# EAGLE schematic Tiny Tetris v1.2 (EAGLE 7.0.0)
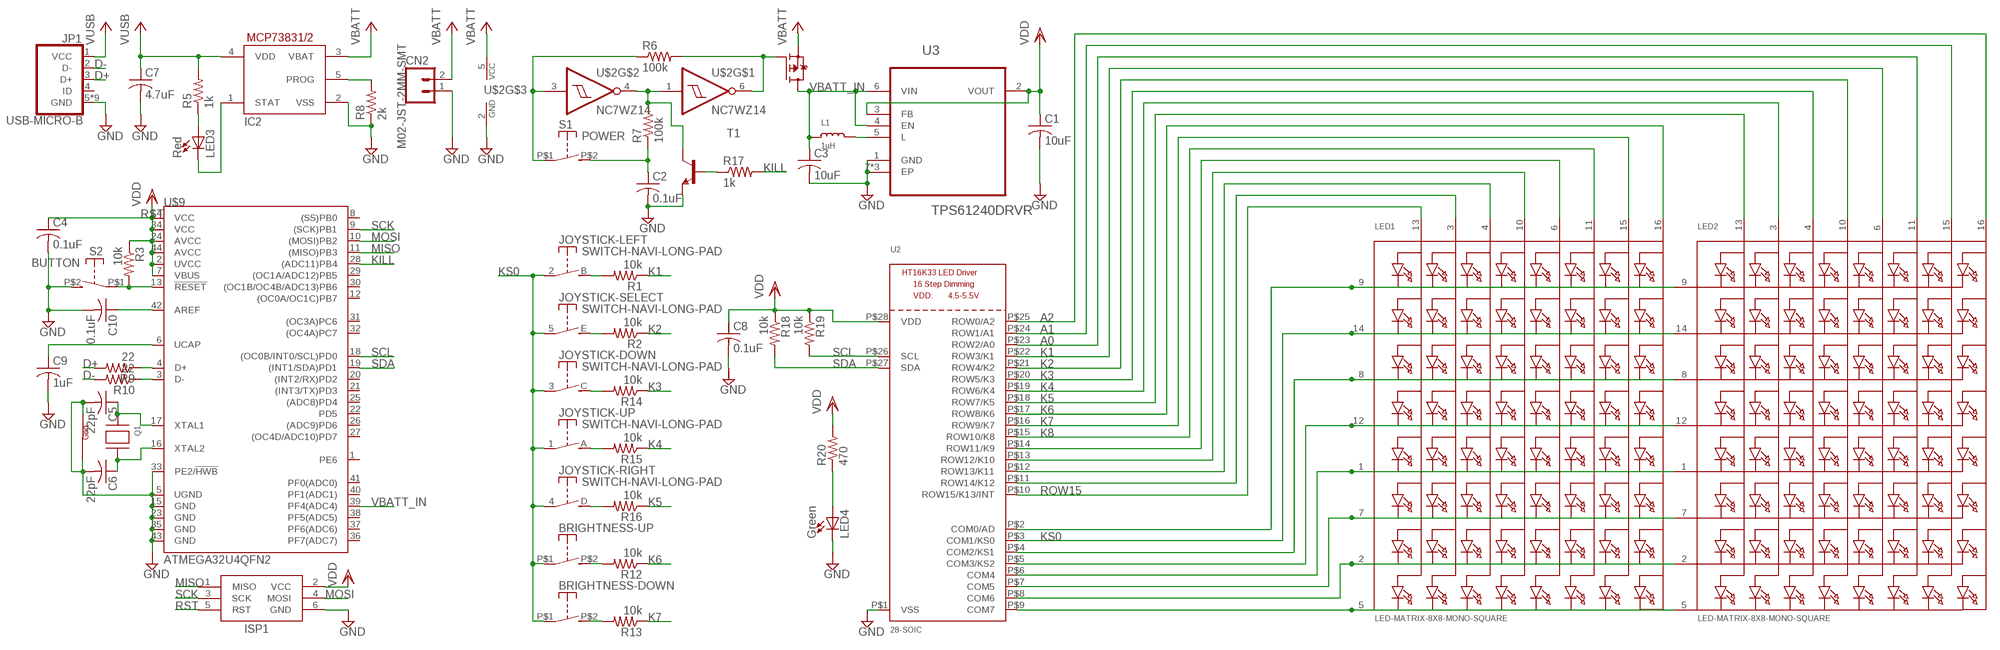
[diagram p0: schematic, sheet 1]

## Parts
BRIGHTNESS-DOWN  SWITCH-TACTSKRELGE010  [TACT-ALPS-SKRELGE010]
BRIGHTNESS-UP  SWITCH-TACTSKRELGE010  [TACT-ALPS-SKRELGE010]
C1  10uF  C-USC0603K  [C0603K]
C2  0.1uF  C-USC0603K  [C0603K]
C3  10uF  C-USC0603K  [C0603K]
C4  0.1uF  C-USC0603K  [C0603K]
C5  22pF  C-USC0603K  [C0603K]
C6  22pF  C-USC0603K  [C0603K]
C7  4.7uF  C-USC0603K  [C0603K]
C8  0.1uF  C-USC0603K  [C0603K]
C9  1uF  C-USC0603K  [C0603K]
C10  0.1uF  C-USC0603K  [C0603K]
CN2  M02-JST-2MM-SMT  M021X02_NO_SILK  [1X02_NO_SILK]
IC2  MCP73831/OT  [SOT23-5L]
ISP1  AVRISP-6  [AVRISP]
JOYSTICK-  SWITCH-NAVI-LONG-PAD  [JOYSTICK-NOKIA-3230-LONG-PAD]
JP1  USB-MICRO-B  [MICRO-USB-FCI-10103594]
L1  1uH  INDUCTOR0805  [0805]
LED1  LED-MATRIX-8X8-MONO-SQUARE  [LED-MATRIX-8X8-MONO-SQUARE]
LED2  LED-MATRIX-8X8-MONO-SQUARE  [LED-MATRIX-8X8-MONO-SQUARE]
LED3  Red  LED  [LED-0603-SIDEVIEW]
LED4  Green  LED  [LED-0603-SIDEVIEW]
Q1  XTAL-4-3225  [NX3225]
R1  10k  R-US_R0603  [R0603]
R2  10k  R-US_R0603  [R0603]
R3  10k  R-US_R0603  [R0603]
R5  1k  R-US_R0603  [R0603]
R6  100k  R-US_R0603  [R0603]
R7  100k  R-US_R0603  [R0603]
R8  2k  R-US_R0603  [R0603]
R9  22  R-US_R0603  [R0603]
R10  22  R-US_R0603  [R0603]
R12  10k  R-US_R0603  [R0603]
R13  10k  R-US_R0603  [R0603]
R14  10k  R-US_R0603  [R0603]
R15  10k  R-US_R0603  [R0603]
R16  10k  R-US_R0603  [R0603]
R17  1k  R-US_R0603  [R0603]
R18  10k  R-US_R0603  [R0603]
R19  10k  R-US_R0603  [R0603]
R20  470  R-US_R0603  [R0603]
S1  POWER  SWITCH-TACTSKRELGE010  [TACT-ALPS-SKRELGE010]
S2  BUTTON  SWITCH-TACTSKRELGE010  [TACT-ALPS-SKRELGE010]
T1  MMBT2222ALT1-NPN-SOT23-BEC  [SOT23-BEC]
U2  28-SOIC  HT16K33_SOP28  [SOP28_300MIL]
U3  TPS61240DRVR  [SON65P200X200X80-7N]
U$1  IRLML6402  [SOT23]
U$2  NC7WZ14  [SC-70-6]
U$9  ATMEGA32U4QFN2  [SPARKFUN-DIGITALIC_QFN-44-NOPAD]

## Nets
A0: LED2.11(A6) U2.P$23(ROW2/A0)
A1: LED2.15(A7) U2.P$24(ROW1/A1)
A2: LED2.16(A8) U2.P$25(ROW0/A2)
D+: JP1.3(D+) R9.2
D-: JP1.2(D-) R10.2
GND: C1.2 C2.2 C3.2 C4.2 C5.2 C6.2 C7.2 C8.2 C9.2 C10.2 CN2.1 IC2.2(VSS) ISP1.6(GND) JP1.5(GND) JP1.P$1(GND) JP1.P$2(GND) JP1.P$3(GND) JP1.P$4(GND) JP1.P$5(GND) JP1.P$6(GND) JP1.P$7(GND) JP1.P$8(GND) LED4.P$2(C) Q1.2(G2) Q1.4(G1) R8.1 S2.P$2(S) T1.E U2.P$1(VSS) U3.1(GND) U3.7(EP) U3.8(EP) U3.9(EP) U$2.2(GND) U$9.5(UGND) U$9.15(GND) U$9.23(GND) U$9.33(PE2/!HWB) U$9.35(GND) U$9.43(GND)
K1: LED2.6(A5) R1.1 U2.P$22(ROW3/K1)
K2: LED2.10(A4) R2.1 U2.P$21(ROW4/K2)
K3: LED2.4(A3) R14.1 U2.P$20(ROW5/K3)
K4: LED2.3(A2) R15.1 U2.P$19(ROW6/K4)
K5: LED2.13(A1) R16.1 U2.P$18(ROW7/K5)
K6: LED1.16(A8) R12.1 U2.P$17(ROW8/K6)
K7: LED1.15(A7) R13.1 U2.P$16(ROW9/K7)
K8: LED1.11(A6) U2.P$15(ROW10/K8)
KILL: R17.2 U$9.28((ADC11)PB4)
KS0: BRIGHTNESS-DOWN.P$1(P) BRIGHTNESS-UP.P$1(P) JOYSTICK-.1(UP:P) JOYSTICK-.2(LEFT:P) JOYSTICK-.3(DOWN:P) JOYSTICK-.4(RIGHT:P) JOYSTICK-.5(SELECT:P) LED1.14(K2) LED2.14(K2) U2.P$3(COM1/KS0)
MISO: ISP1.1(MISO) U$9.11((MISO)PB3)
MOSI: ISP1.4(MOSI) U$9.10((MOSI)PB2)
N$1: LED1.5(K8) LED2.5(K8) U2.P$9(COM7)
N$2: LED3.P$1(A) R5.1
N$3: JOYSTICK-.C(DOWN:S) R14.2
N$4: R6.2 U$1.1(G) U$2.6(O)
N$5: R17.1 T1.B
N$6: R6.1 S1.P$1(P) U$2.3(I)
N$7: JOYSTICK-.E(SELECT:S) R2.2
N$8: LED1.9(K1) LED2.9(K1) U2.P$2(COM0/AD)
N$9: JOYSTICK-.D(RIGHT:S) R16.2
N$10: C2.1 R7.1 S1.P$2(S)
N$11: JOYSTICK-.B(LEFT:S) R1.2
N$12: R7.2 T1.C U$2.1(I) U$2.4(O)
N$13: JOYSTICK-.A(UP:S) R15.2
N$15: C10.1 U$9.42(AREF)
N$16: R9.1 U$9.4(D+)
N$17: IC2.1(STAT) LED3.P$2(C)
N$18: IC2.5(PROG) R8.2
N$19: R10.1 U$9.3(D-)
N$20: C9.1 U$9.6(UCAP)
N$21: BRIGHTNESS-UP.P$2(S) R12.2
N$22: LED1.3(A2) U2.P$11(ROW14/K12)
N$23: LED1.4(A3) U2.P$12(ROW13/K11)
N$24: LED1.10(A4) U2.P$13(ROW12/K10)
N$25: LED1.6(A5) U2.P$14(ROW11/K9)
N$26: BRIGHTNESS-DOWN.P$2(S) R13.2
N$27: LED4.P$1(A) R20.1
N$29: L1.2 U3.5(L)
N$30: LED1.8(K3) LED2.8(K3) U2.P$4(COM2/KS1)
N$31: C5.1 Q1.1(X1) U$9.17(XTAL1)
N$32: LED1.12(K4) LED2.12(K4) U2.P$5(COM3/KS2)
N$33: LED1.1(K5) LED2.1(K5) U2.P$6(COM4)
N$34: LED1.7(K6) LED2.7(K6) U2.P$7(COM5)
N$35: LED1.2(K7) LED2.2(K7) U2.P$8(COM6)
N$36: C6.1 Q1.3(X2) U$9.16(XTAL2)
ROW15: LED1.13(A1) U2.P$10(ROW15/K13/INT)
RST: ISP1.5(RST) R3.2 S2.P$1(P) U$9.13(!RESET)
SCK: ISP1.3(SCK) U$9.9((SCK)PB1)
SCL: R19.2 U2.P$26(SCL) U$9.18((OC0B/INT0/SCL)PD0)
SDA: R18.2 U2.P$27(SDA) U$9.19((INT1/SDA)PD1)
VBATT: CN2.2 IC2.3(VBAT) U$1.2(S) U$2.5(VCC)
VBATT_IN: C3.1 L1.1 U3.4(EN) U3.6(VIN) U$1.3(D) U$9.39(PF4(ADC4))
VDD: C1.1 C4.1 C8.1 ISP1.2(VCC) R3.1 R18.1 R19.1 R20.2 U2.P$28(VDD) U3.2(VOUT) U3.3(FB) U$9.2(UVCC) U$9.7(VBUS) U$9.14(VCC) U$9.24(AVCC) U$9.34(VCC) U$9.44(AVCC)
VUSB: C7.1 IC2.4(VDD) JP1.1(VCC) R5.2
Unconnected: JP1.4(ID) U$9.1(PE6) U$9.8((SS)PB0) U$9.12((OC0A/OC1C)PB7) U$9.20((INT2/RX)PD2) U$9.21((INT3/TX)PD3) U$9.22(PD5) U$9.25((ADC8)PD4) U$9.26((ADC9)PD6) U$9.27((OC4D/ADC10)PD7) U$9.29((OC1A/ADC12)PB5) U$9.30((OC1B/OC4B/ADC13)PB6) U$9.31((OC3A)PC6) U$9.32((OC4A)PC7) U$9.36(PF7(ADC7)) U$9.37(PF6(ADC6)) U$9.38(PF5(ADC5)) U$9.40(PF1(ADC1)) U$9.41(PF0(ADC0))

## Library data of the parts
BRIGHTNESS-DOWN BRIGHTNESS-UP S1 S2 = Jianan Li:SWITCH-TACT
C1-C10 = resistor:C-US: CAPACITOR, American symbol
CN2 = SparkFun-Connectors:M02: Standard 2-pin 0.1" header. Use with - straight break away headers ( PRT-00116) - right angle break away headers (PRT-00553) - swiss pins (PRT-00743) - machine pins (PRT-00117) - female headers (PRT-00115) Molex polarized connector foot print use with: PRT-08233 with associated crimp pins and housings. 2.54_SCREWTERM for use with PRT-10571. 3.5mm Screw Terminal footprints for PRT-08084 5mm Screw Terminal footprints for use with PRT-08433
IC2 = adafruit:MCP73831: MCP73831/2 Miniature Single-Cell, Fully Integrated Li-Ion, Li-Polymer Charge Management Controllers. Nice and small simple lipoly charge controller, with adjustable current and status output (LED) http://www.ladyada.net/library/pcb/eaglelibrary.html
ISP1 = adafruit:AVRISP: AVR ISP HEADER Standard 6 pin header for AVR programming
JOYSTICK- = Jianan Li:SWITCH-NAVI
JP1 = Jianan Li:USB-MICRO-B
L1 = microbuilder:INDUCTOR: Inductors 0603: 10nH Ceramic Inductor - microwire antenna/RF (Digikey: 712-1434-2-ND) 0805: 560nH Ceramic Inductor - RF (Digikey: 553-1047-1-ND) 270nH Ceramic Inductor - Q = 40@250MHz, +-5%, 1 Ohm DC Resistance (Digikey: 535-10506-2-ND) 1007 (2518 Metric) SMT: 10µH 10% 250mOhm 820mA 1007 Inductor (Digikey: 587-2189-1-ND) 22µH 10% 500mOhm 580mA 1007 Inductor (Digikey: 587-2190-1-ND) 47µH 10% 950mOhm 420mA 1007 Inductor (Digikey: 587-2191-1-ND) 47µH 5% 100mOhm 1A 1008 Inductor (Digikey: 732-1816-1-ND) 5.0x5.0mm (Taiyo Yuden NR5040 Series) 6.8µH 20% 2.3A 64mOhm Inductor (Digikey: 587-2374-2-ND) 5.0x5.0mm (TDK VLC5045 Series) 4.7µH 20% 3.3A 34mOhm Inductor (Digikey: 445-6526-1-ND) 6.8µH 20% 2.7A 46mOhm Inductor (Digikey: 445-6527-1-ND) 6.0x6.0mm (TDK VLC6045 Series) 4.7µH 20% 3.8A 27mOhm Inductor (Digikey: 445-6538-2-ND) 6.8µH 20% 3A 41mOhm Inductor (Digikey: 445-6540-1-ND) 6.2µH 30% 2.2A 45mOhm Inductor (Digikey: SRR5028-6R2YCT-ND) - Not TDK VLC6045 but footprint should match 6.0x6.0mm (TDK SLF6045 Series) 6.8uH 30% 2A 33mOhm Inductor (Digikey: 445-4572-1-ND, Mouser: 810-SLF645T6R8N2R0PF)
LED1 LED2 = Jianan Li:LED-MATRIX-8X8-MONO-SQUARE
LED3 LED4 = Jianan Li:LED
Q1 = adafruit:XTAL-4: Classic 4-pin 3.2 x 2.5mm crystal
R1-R3 R5-R10 R12-R20 = resistor:R-US_: RESISTOR, American symbol
T1 = transistor:*-NPN-: NPN Transistror BF959 corrected 2008.03.06
U2 = microbuilder:HT16K33_SOP28
U3 = Texas Instruments_By_element14_Batch_1:TPS61240DRVR: 3.5-MHz High Efficiency Step-Up Converter; MPN: TPS61240DRVR; OC_FARNELL: -; OC_NEWARK: 25R0113; PACKAGE: SON-6; SUPPLIER: Texas Instruments
U$1 = Jianan Li:IRLML6402
U$2 = Jianan Li:NC7WZ14
U$9 = SparkFun-DigitalIC:ATMEGA32U4: Atmel 44-pin 8-bit Microcontroller with 32KBytes of ISP Flash and USB Controller ----- Please use the QFN-44-NOPAD_1:1 package for the footprint of all boards using a 32U4. Route traces directly away from the pads as much as possible.